# EAGLE design fish-1.0 (EAGLE 7.7.0)
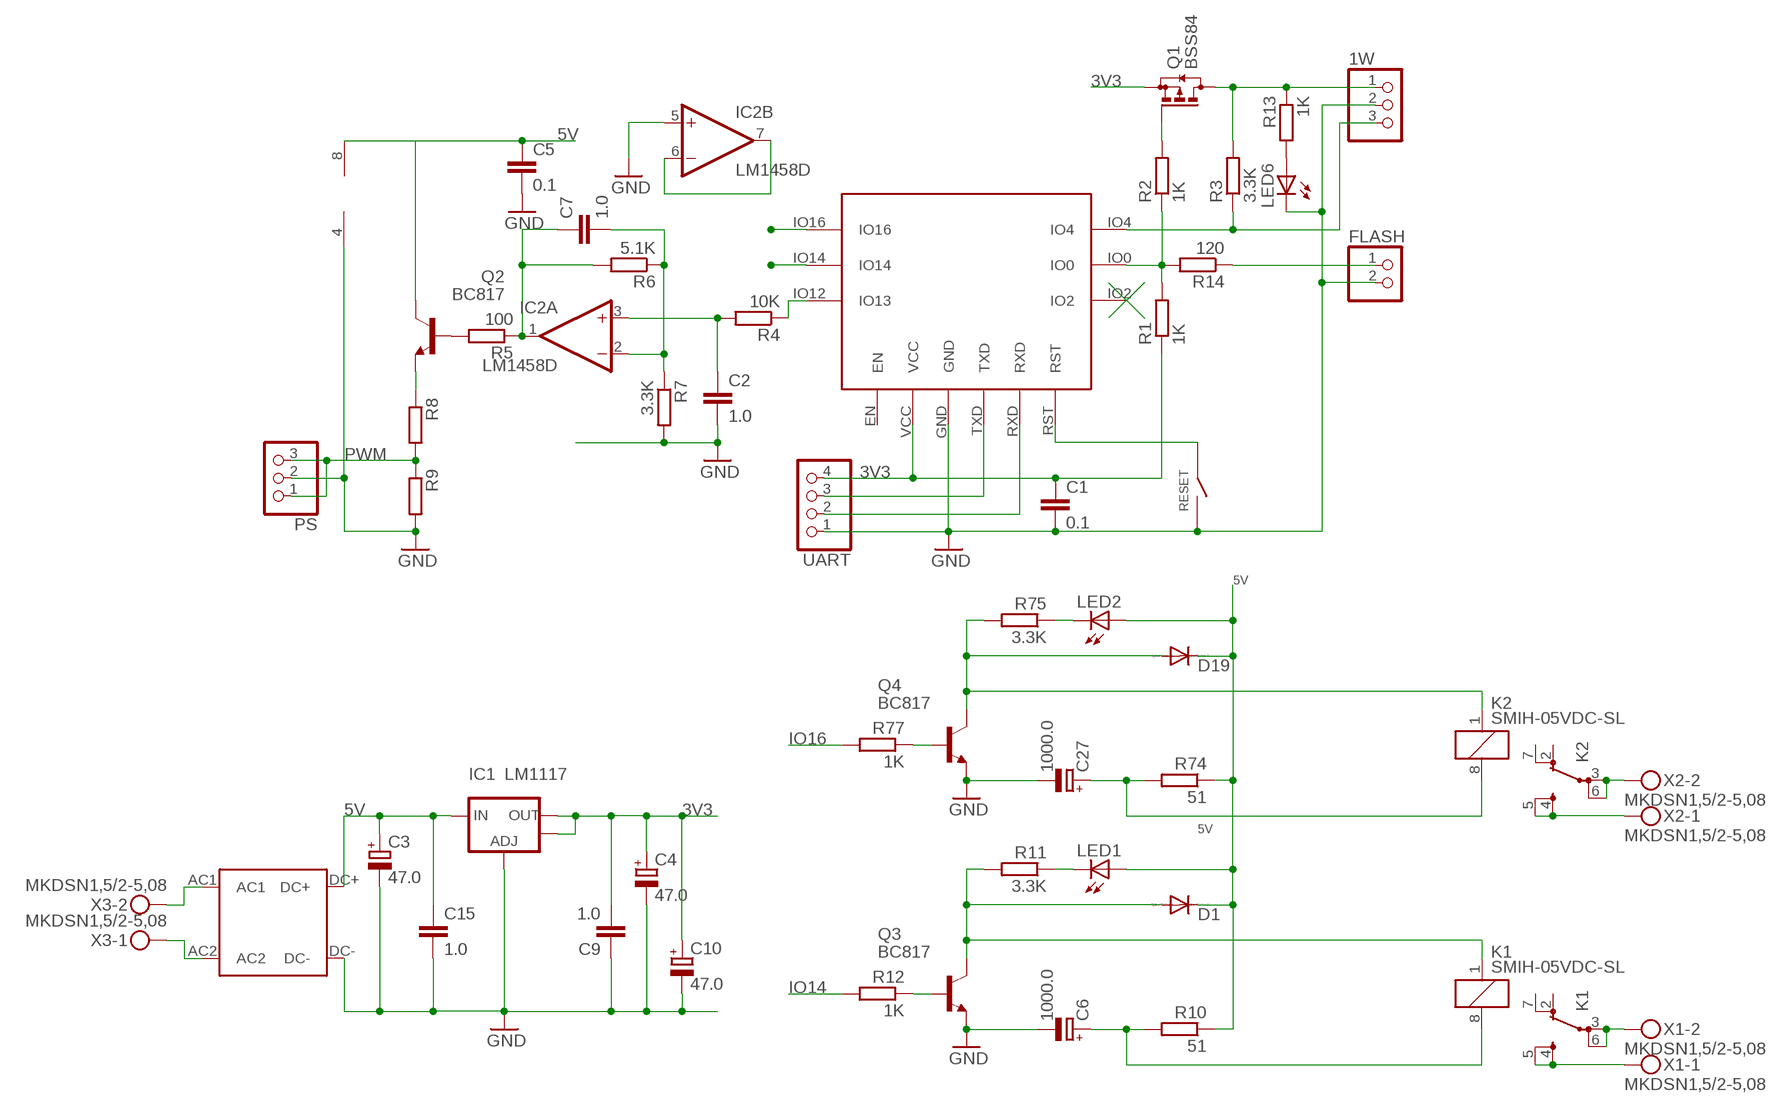
[diagram p0: schematic, sheet 1]

## Parts
1W  PINHD-1X3/90  [1X03/90]
C1  0.1  C-EUC0805  [C0805]
C2  1.0  C-EUC0805  [C0805]
C3  47.0  CPOL-EUSMCD  [SMC_D]
C4  47.0  CPOL-EUSMCB  [SMC_B]
C5  0.1  C-EUC0805  [C0805]
C6  1000.0  CPOL-EUE3.5-8  [E3,5-8]
C7  1.0  C-EUC0805  [C0805]
C9  1.0  C-EUC0805  [C0805]
C10  47.0  CPOL-EUSMCD  [SMC_D]
C15  1.0  C-EUC0805  [C0805]
C27  1000.0  CPOL-EUE3.5-8  [E3,5-8]
D1  DIODE-SOD123  [SOD123]
D19  DIODE-SOD123  [SOD123]
ESP-M3  ESP-M3  [ESP-M3]
FLASH  PINHD-1X2/90  [1X02/90]
IC1  LM1117  V_REG_LM1117SOT223  [SOT223]
IC2  LM1458D  [SO08]
K1  SMIH-05VDC-SL  FTR-K1C  [FTR-K1C]
K2  SMIH-05VDC-SL  FTR-K1C  [FTR-K1C]
LED1  LEDSMT1206  [1206]
LED2  LEDSMT1206  [1206]
LED6  LEDSMT1206  [1206]
PS  PINHD-1X3/90  [1X03/90]
Q1  BSS84  [SOT23]
Q2  BC817  BC817-40SMD  [SOT23-BEC]
Q3  BC817  BC817-40SMD  [SOT23-BEC]
Q4  BC817  BC817-40SMD  [SOT23-BEC]
R1  1K  R-EU_R0603  [R0603]
R2  1K  R-EU_R0603  [R0603]
R3  3.3K  R-EU_R0603  [R0603]
R4  10K  R-EU_R0603  [R0603]
R5  100  R-EU_R0603  [R0603]
R6  5.1K  R-EU_R0603  [R0603]
R7  3.3K  R-EU_R0603  [R0603]
R8  R-EU_R0603  [R0603]
R9  R-EU_R0603  [R0603]
R10  51  R-EU_R1206  [R1206]
R11  3.3K  R-EU_R0603  [R0603]
R12  1K  R-EU_R0603  [R0603]
R13  1K  R-EU_R0603  [R0603]
R14  120  R-EU_R0603  [R0603]
R74  51  R-EU_R1206  [R1206]
R75  3.3K  R-EU_R0603  [R0603]
R77  1K  R-EU_R0603  [R0603]
RESET  TACT3X4  [TACT3X4]
U$1  AC-DC/10W-12V  [AC-DC/10W]
UART  PINHD-1X4/90  [1X04/90]
X1  MKDSN1,5/2-5,08  [MKDSN1,5/2-5,08]
X2  MKDSN1,5/2-5,08  [MKDSN1,5/2-5,08]
X3  MKDSN1,5/2-5,08  [MKDSN1,5/2-5,08]

## Nets
1W: 1W.3 ESP-M3.IO4 R3.1
3V3: C1.1 C4.+ C9.2 C10.+ ESP-M3.VCC IC1.2(OUT) IC1.4(OUT) Q1.2(S) R1.1 UART.4
5V: C3.+ C5.1 C15.1 D1.C D19.C IC1.3(IN) IC2.8(P:V+) LED1.A LED2.A Q2.C R10.1 R74.1 U$1.DC+
FLASH: FLASH.1 R14.1
GND: 1W.2 C1.2 C2.2 C3.- C4.- C5.2 C6.- C9.1 C10.- C15.2 C27.- ESP-M3.GND FLASH.2 IC1.1(ADJ) IC2.4(P:V-) IC2.5(B:+IN) LED6.C PS.2 Q3.E Q4.E R7.2 R9.2 RESET.P$2 U$1.DC- UART.1
IO14: ESP-M3.IO14 R12.2
IO16: ESP-M3.IO16 R77.2
N$3: Q1.1(G) R2.2
N$4: U$1.AC1 X3.2
N$5: ESP-M3.IO12(IO13) R4.1
N$6: U$1.AC2 X3.1
N$7: C2.1 IC2.3(A:+IN) R4.2
N$8: C7.1 IC2.1(A:OUT) R5.1 R6.2
N$9: C7.2 IC2.2(A:-IN) R6.1 R7.1
N$10: D1.A K1.1 Q3.C R11.2
N$11: Q2.B R5.2
N$12: Q2.E R8.1
N$13: C6.+ K1.8 R10.2
N$14: LED1.C R11.1
N$15: Q3.B R12.1
N$16: K1.3(-1:PA) K1.6(-1:PB) X1.2
N$17: ESP-M3.IO0 R1.2 R2.1 R14.2
N$18: LED6.A R13.2
N$19: IC2.6(B:-IN) IC2.7(B:OUT)
N$20: K1.4(-1:SA) K1.5(-1:SB) X1.1
N$55: D19.A K2.1 Q4.C R75.2
N$60: C27.+ K2.8 R74.2
N$62: LED2.C R75.1
N$112: Q4.B R77.1
N$128: K2.3(-1:PA) K2.6(-1:PB) X2.2
N$129: K2.4(-1:SA) K2.5(-1:SB) X2.1
PWM: PS.1 PS.3 R8.2 R9.1
RST: ESP-M3.RST RESET.P$1
RX1: ESP-M3.RXD UART.2
TX1: ESP-M3.TXD UART.3
VCC: 1W.1 Q1.3(D) R3.2 R13.1
Unconnected: ESP-M3.EN ESP-M3.IO2 K1.2(-1:OA) K1.7(-1:OB) K2.2(-1:OA) K2.7(-1:OB)

## Library data of the parts
1W PS = pinhead:PINHD-1X3: PIN HEADER
C1 C2 C5 C7 C9 C15 = rcl:C-EU: CAPACITOR, European symbol
C3 C4 C6 C10 C27 = rcl:CPOL-EU: POLARIZED CAPACITOR, European symbol
D1 D19 = diode:DIODE-: DIODE
ESP-M3 = esp8266modules:ESP-M3: ESP8285 Model M3
FLASH = pinhead:PINHD-1X2: PIN HEADER
IC1 = SparkFun:V_REG_LM1117: Voltage Regulator LM1117 Standard adjustable voltage regulator but in SMD form. Spark Fun Electronics SKU : COM-00595
IC2 = linear:*1458: OP AMP
K1 K2 = relay:FTR-K1C: NETZRELAIS FTR-K1CK024W1XUM 16A/250VAC 1 Umschaltkontakt Distributor: Conrad Electronic Bestell Nr.: 504389-13 - 24V Source: http://www.produktinfo.conrad.com/datenblaetter/500000-524999/504384-da-01-de-NETZRELAIS_FTR_K1CK012W1XUM_16A_250VAC.pdf; OC_FARNELL: unknown; OC_NEWARK: unknown
LED1 LED2 LED6 = led:LED: LED OSRAM: - CHIPLED LG R971, LG N971, LY N971, LG Q971, LY Q971, LO R971, LY R971 LH N974, LH R974 LS Q976, LO Q976, LY Q976 LO Q996 - Hyper CHIPLED LW Q18S LB Q993, LB Q99A, LB R99A - SideLED LS A670, LO A670, LY A670, LG A670, LP A670 LB A673, LV A673, LT A673, LW A673 LH A674 LY A675 LS A676, LA A676, LO A676, LY A676, LW A676 LS A679, LY A679, LG A679 - Hyper Micro SIDELED® LS Y876, LA Y876, LO Y876, LY Y876 LT Y87S - SmartLED LW L88C, LW L88S LB L89C, LB L89S, LG L890 LS L89K, LO L89K, LY L89K LS L896, LA L896, LO L896, LY L896 - TOPLED LS T670, LO T670, LY T670, LG T670, LP T670 LSG T670, LSP T670, LSY T670, LOP T670, LYG T670 LG T671, LOG T671, LSG T671 LB T673, LV T673, LT T673, LW T673 LH T674 LS T676, LA T676, LO T676, LY T676, LB T676, LH T676, LSB T676, LW T676 LB T67C, LV T67C, LT T67C, LS T67K, LO T67K, LY T67K, LW E67C LS E67B, LA E67B, LO E67B, LY E67B, LB E67C, LV E67C, LT E67C LW T67C LS T679, LY T679, LG T679 LS T770, LO T770, LY T770, LG T770, LP T770 LB T773, LV T773, LT T773, LW T773 LH T774 LS E675, LA E675, LY E675, LS T675 LS T776, LA T776, LO T776, LY T776, LB T776 LHGB T686 LT T68C, LB T68C - Hyper Mini TOPLED® LB M676 - Mini TOPLED Santana® LG M470 LS M47K, LO M47K, LY M47K Source: http://www.osram.convergy.de LUXEON: - LUMILED® LXK2-PW12-R00, LXK2-PW12-S00, LXK2-PW14-U00, LXK2-PW14-V00 LXK2-PM12-R00, LXK2-PM12-S00, LXK2-PM14-U00 LXK2-PE12-Q00, LXK2-PE12-R00, LXK2-PE12-S00, LXK2-PE14-T00, LXK2-PE14-U00 LXK2-PB12-K00, LXK2-PB12-L00, LXK2-PB12-M00, LXK2-PB14-N00, LXK2-PB14-P00, LXK2-PB14-Q00 LXK2-PR12-L00, LXK2-PR12-M00, LXK2-PR14-Q00, LXK2-PR14-R00 LXK2-PD12-Q00, LXK2-PD12-R00, LXK2-PD12-S00 LXK2-PH12-R00, LXK2-PH12-S00 LXK2-PL12-P00, LXK2-PL12-Q00, LXK2-PL12-R00 Source: www.luxeon.com KINGBRIGHT: KA-3528ASYC Source: www.kingbright.com
Q1 = transistor-small-signal:BSS84: P-CHANNEL MOS FET
Q2-Q4 = transistor-npn:BC817*: NPN Transistor
R1-R14 R74 R75 R77 = rcl:R-EU_: RESISTOR, European symbol
RESET = custom:TACT3X4
U$1 = components:AC-DC/10W-12V
UART = pinhead:PINHD-1X4: PIN HEADER
X1-X3 = con-phoenix-508:MKDSN1,5/2-5,08: MKDSN 1,5/ 2-5,08 Printklemme Nennstrom: 13,5 A Nennspannung: 250 V Rastermaß: 5,08 mm Polzahl: 2 Anschlussart: Schraubanschluss Montage: Löten Anschlussrichtung Leiter/Platine: 0 ° Artikelnummer: 1729128 Source: http://eshop.phoenixcontact.com .. 1729128.pdf

## Net classes
0 default: width 0.254 mm, clearance 0.254 mm
1 POWER: width 0.508 mm, clearance 0.254 mm

## Board
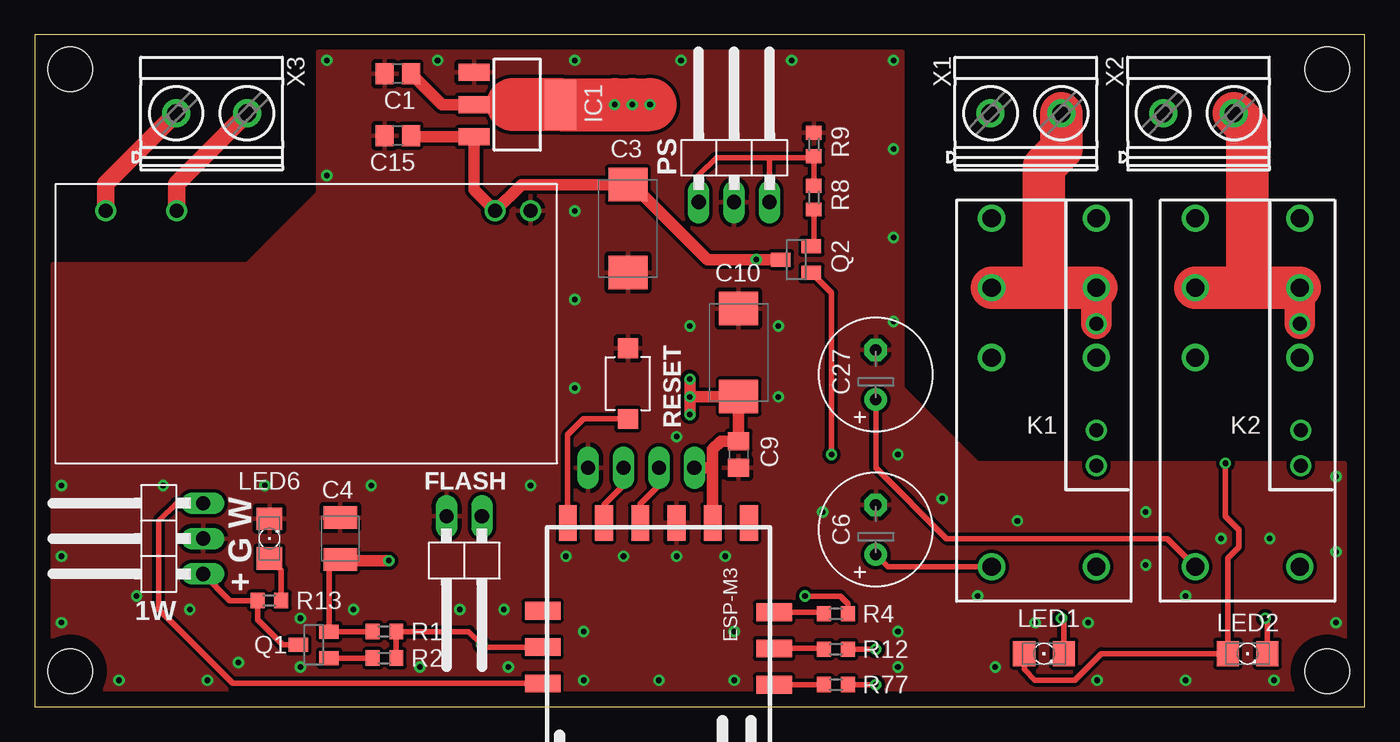
[diagram p1: board, top side]
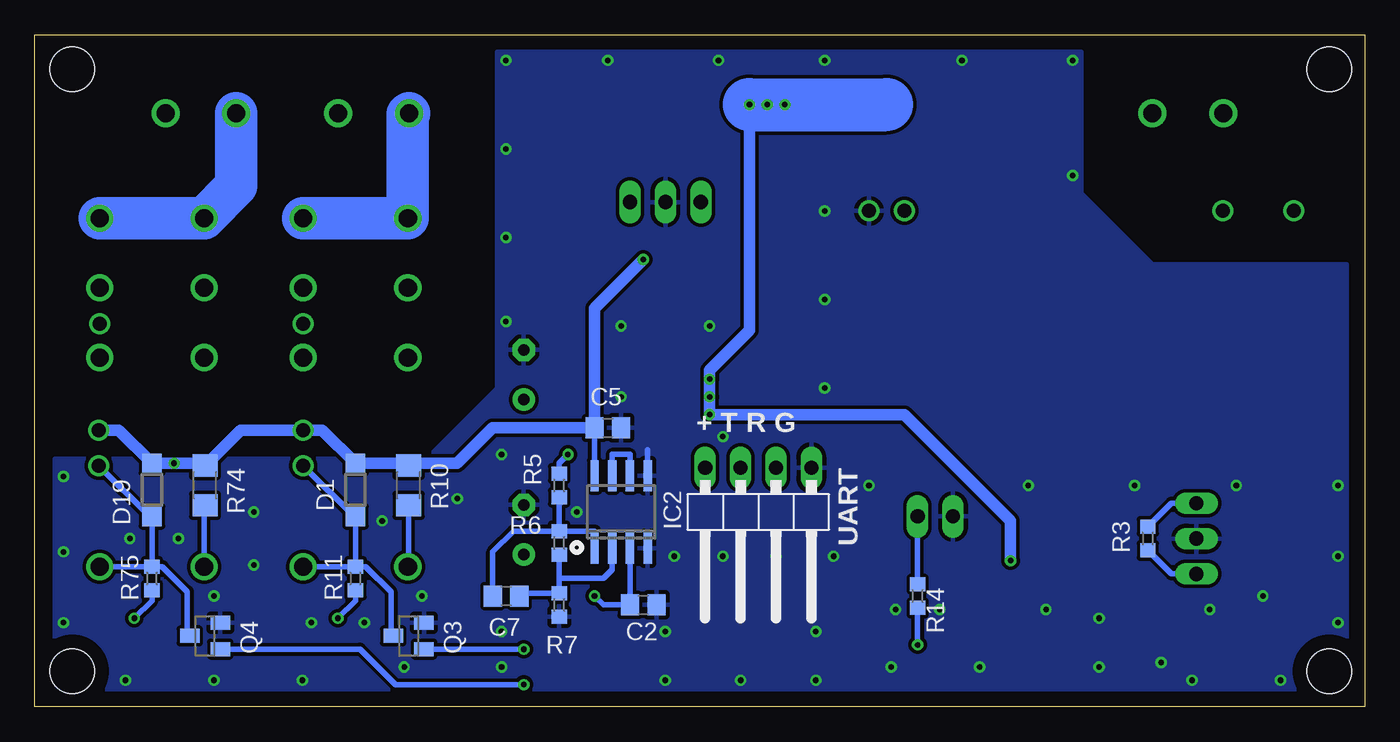
[diagram p2: board, bottom side, seen from below]

Size 95.4 x 48.18 mm. Coordinates in mm from the lower left corner, seen from the top.
Outline: 0,0 95.39,0 95.39,48.18 0,48.18 0,0
Copper layers (1*16): Top 0.035mm / dielectric 1.5mm / Bottom 0.035mm
Design rules "default *": minimum track width 10mil, minimum drill 24mil, track to track 8mil, track to pad 8mil, pad to pad 8mil, via to via 8mil, smd to smd 8mil, copper to edge 40mil, drill to drill 8mil, minimum pad ring 10mil, minimum via ring 8mil, stop-mask expansion 4mil, vias tented up to drill 20mil, thermal gap 12mil
Holes 3.2 mm at 2.54,2.54 2.54,45.72 92.71,2.54 92.71,45.72

### Footprints (pad centres in the part's own frame; a part is rotated, then mirrored left to right if it is on the bottom)
1X03/90 = drill 1.016 long: 1 -2.54,-3.81; 2 0,-3.81; 3 2.54,-3.81
C0805 = smd 1.3 x 1.5: 1 -0.95,0; 2 0.95,0
SMC_D = smd 2.4 x 2.8: + -3.15,0; - 3.15,0
SMC_B = smd 1.6 x 2.4: + -1.5,0; - 1.5,0
E3,5-8 = drill 0.813 pad 1.6: + -1.778,0 | drill 0.813 pad 1.6 octagon: - 1.778,0
SOD123 = smd 1.4 x 1.4: A 1.9,0; C -1.9,0
ESP-M3 = smd 1.27 x 2.54: EN -6.46,-8.1; GND -1.26,-8.1; RST 6.54,-8.1; RXD 3.94,-8.1; TXD 1.34,-8.1; VCC -3.86,-8.1 | smd 2.54 x 1.27: IO0 8.34,0.8; IO2 8.34,-1.8; IO4 8.34,3.4; IO12 -8.26,-1.7; IO14 -8.26,0.9; IO16 -8.26,3.5
1X02/90 = drill 1.016 long: 1 -1.27,-3.81; 2 1.27,-3.81
SOT223 = smd 1.219 x 2.235: 1 -2.311,-3.099; 2 0,-3.099; 3 2.311,-3.099 | smd 3.6 x 2.2: 4 0,3.099
SO08 = smd 0.6 x 2.2: 1 -1.905,-2.6; 2 -0.635,-2.6; 3 0.635,-2.6; 4 1.905,-2.6; 5 1.905,2.6; 6 0.635,2.6; 7 -0.635,2.6; 8 -1.905,2.6
FTR-K1C = drill 1.3 pad 1.93: 1 -12.5,-3.75; 2 2.5,-3.75; 3 7.5,-3.75; 4 12.5,-3.75; 5 12.5,3.75; 6 7.5,3.75; 7 2.5,3.75; 8 -12.5,3.75
1206 = smd 1.6 x 1.803: A -1.422,0; C 1.422,0
SOT23 = smd 1 x 1.4: 1 -0.95,-1.1; 2 0.95,-1.1; 3 0,1.1
SOT23-BEC = smd 1 x 1.4: B -0.95,-1.1; C 0,1.1; E 0.95,-1.1
R0603 = smd 1 x 1.1: 1 -0.85,0; 2 0.85,0
R1206 = smd 1.6 x 1.803: 1 -1.422,0; 2 1.422,0
TACT3X4 = smd 1.422 x 1.422: P$1 -0.635,1.587; P$2 4.445,1.587
AC-DC/10W = drill 1: AC1 10.16,-7.62; AC2 15.24,-7.62; DC+ -12.7,-7.62; DC- -15.24,-7.62
1X04/90 = drill 1.016 long: 1 -3.81,-3.81; 2 -1.27,-3.81; 3 1.27,-3.81; 4 3.81,-3.81
MKDSN1,5/2-5,08 = drill 1.3 pad 2: 1 -2.561,0.025; 2 2.519,0.025

### Placement (x,y rotation side)
1W  8.26,12.06 90 top
C1  26.04,45.4 180 top
C2  51.75,7.3 0 bottom
C3  42.55,34.29 270 top
C4  21.91,12.06 90 top
C5  54.29,20 0 bottom
C6  60.33,12.7 90 top
C7  61.59,7.94 0 bottom
C9  50.48,18.1 90 top
C10  50.48,25.4 90 top
C15  26.04,40.96 180 top
C27  60.33,23.81 90 top
D1  72.39,15.56 270 bottom
D19  87,15.56 270 bottom
ESP-M3  44.77,5.08 180 top
FLASH  30.8,9.84 180 top
IC1  34.61,43.18 270 top
IC2  53.34,13.97 0 bottom
K1  72.39,22.54 90 top
K2  87,22.54 90 top
LED1  72.39,3.81 0 top
LED2  87,3.81 0 top
LED6  16.83,12.06 90 top
PS  50.16,40.01 0 top
Q1  20,4.45 90 top
Q2  54.61,32.07 90 top
Q3  68.58,5.08 90 bottom
Q4  83.19,5.08 90 bottom
R1  25.08,5.4 0 top
R2  25.08,3.49 180 top
R3  15.56,12.06 270 bottom
R4  57.47,6.67 0 top
R5  57.78,15.88 90 bottom
R6  57.78,11.75 90 bottom
R7  57.78,7.3 270 bottom
R8  55.88,36.51 90 top
R9  55.88,40.32 90 top
R10  68.58,15.88 270 bottom
R11  72.39,9.21 90 bottom
R12  57.47,4.13 180 top
R13  16.83,7.62 0 top
R14  32.07,7.94 270 bottom
R74  83.19,15.88 270 bottom
R75  87,9.21 90 bottom
R77  57.47,1.59 180 top
RESET  44.13,21.27 90 top
U$1  20.32,27.94 180 top
UART  43.5,13.34 180 bottom
X1  71.12,42.55 0 top
X2  83.5,42.55 0 top
X3  12.7,42.55 0 top

### Tracks (layer width: path | path; a pad name or v marks a point on that pad's centre or on a via)
1W
  Top 0.406: ESP-M3.IO4 14.2,1.68 8.89,6.99 8.89,13.34 10.16,14.61 1W.3
  Bottom 0.406: 1W.3 13.87,14.61 R3.1
3V3  (via drill 0.4)
  Top 0.406: C4.+ 21.1,9.76 Q1.2 R1.1
  Top 0.813: C1.1 29.21,43.18 IC1.2 34.29,43.18 | ESP-M3.VCC 48.63,17.14 | 48.63,17.14 48.63,18.46 49.21,19.05 C9.2 C10.+ 47.02,22.25 v46.99,22.23 | UART.4 48.63,17.14 | v46.99,20.95 v46.99,22.23 | v46.99,22.23 v46.99,23.5 | v25.4,10.48 22,10.48 C4.+
  Top 3.81: 34.29,43.18 IC1.4 v41.59,43.18 v42.86,43.18 v44.13,43.18
  Bottom 0.813: v44.13,43.18 44.13,26.99 46.99,24.13 v46.99,23.5 v46.99,22.23 v46.99,20.95 33.02,20.95 25.4,13.34 v25.4,10.48
  Bottom 3.81: v44.13,43.18 34.29,43.18
5V  (via drill 0.4, 1)
  Top 0.406: LED1.A 70.97,2.69 71.75,1.91 74.61,1.91 76.52,3.81 LED2.A 85.57,10.64 86.36,11.43 86.36,12.7 85.41,13.65 v85.41,17.46
  Top 0.813: C15.1 27.07,40.87 IC1.3 31.51,37.07 U$1.DC+ 34.9,37.44 C3.+ 42.89,37.44 48.26,32.07 v51.75,32.07 Q2.C
  Bottom 0.406: IC2.8 C5.1
  Bottom 0.813: v51.75,32.07 55.24,28.58 C5.1 62.55,20 65.09,17.46 68.58,17.46 | 83.35,17.46 R74.1 | v90.81,19.84 89.38,19.84 D19.C v85.41,17.46 83.35,17.46 R74.1 | R74.1 80.64,19.84 v76.15,19.84 74.77,19.84 D1.C 68.58,17.46 | R10.1 68.58,17.46
FLASH
  Bottom 0.406: R14.1 FLASH.1
GND  (via drill 0.4)
  Bottom 0.406: IC2.5 51.44,18.41
  other vias: 38.73,22.86 35.56,15.88 38.73,29.21 38.73,35.56 24.13,15.88 16.51,15.88 46.99,27.3 9.21,15.88 1.91,15.88 1.91,10.79 1.91,6.03 6.03,1.91 12.38,1.91 11.11,6.99 14.61,3.17 19.05,2.86 27.62,2.86 33.97,2.86 39.37,1.91 38.1,10.79 44.77,1.91 50.16,1.91 42.23,10.79 46.04,10.79 49.53,10.79 61.91,2.86 61.91,5.4 68.9,2.86 65.09,14.92 79.69,13.97 71.75,6.03 75.56,6.03 88.9,1.91 93.34,6.03 93.34,11.11 93.34,16.51 61.59,46.35 54.29,46.35 46.35,46.35 38.73,46.35 28.89,46.35 20.95,38.1 20.95,46.35 61.91,18.1 82.55,1.91 76.2,1.91 67.63,7.94 82.55,7.94 61.59,40.01 61.59,33.66 61.59,27.62 50.16,5.4 39.37,5.4 46.04,19.37 22.86,6.99 19.05,6.35 7.3,7.94 30.48,6.99 33.66,6.99 53.34,22.23 53.34,27.3 56.52,13.97 85.09,12.06 70.48,13.34 88.58,12.06 79.69,10.16
  pour Top: 1.27,31.75 15.24,31.75 20.32,36.83 20.32,46.99 62.23,46.99 62.23,22.86 67.63,17.46 93.98,17.46 93.98,1.27 1.27,1.27
  pour Bottom: 1.27,31.75 15.24,31.75 20.32,36.83 20.32,46.99 62.23,46.99 62.23,22.86 67.31,17.78 93.98,17.78 93.98,1.27 1.27,1.27
IO14
  Top 0.406: ESP-M3.IO14 56.56,4.18 R12.2
IO16
  Top 0.406: ESP-M3.IO16 R77.2
N$3
  Top 0.406: R2.2 Q1.1
N$4
  Top 1.27: U$1.AC1 10.16,37.51 X3.2
N$5
  Top 0.406: ESP-M3.IO12 56.51,6.78 R4.1
N$6
  Top 1.27: U$1.AC2 5.08,37.51 X3.1
N$7  (via drill 0.4)
  Top 0.406: R4.2 58.32,7.41 57.78,7.94 v55.24,7.94
  Bottom 0.406: v55.24,7.94 54.61,7.3 C2.1 IC2.3
N$8
  Bottom 0.406: 57.68,14.61 R5.1 R6.2 | IC2.1 55.24,12.6 R6.2 | C7.1 62.55,11.12 61.06,12.6 R6.2
N$9
  Bottom 0.406: 57.78,9.21 R7.1 60.43,8.15 C7.2 | 57.78,9.21 R6.1 | 57.78,9.21 54.61,9.21 53.98,9.84 IC2.2
N$10  (via drill 1)
  Bottom 0.406: 76.2,10.1 K1.1 72.41,10.04 R11.2 | R11.2 71.65,10.06 69.85,8.26 69.85,5.25 Q3.C | R11.2 D1.A 72.51,13.66 v76.15,17.3
N$11  (via drill 0.4)
  Top 0.406: v57.15,18.1 57.15,29.68 Q2.B
  Bottom 0.406: R5.2 57.78,17.46 v57.15,18.1
N$12
  Top 0.406: R8.1 55.88,33.19 Q2.E
N$13
  Top 0.406: K1.8 61.2,10.04 C6.+
  Bottom 0.406: K1.8 68.58,10.1 R10.2
N$14  (via drill 0.4)
  Top 0.406: LED1.C 73.81,6.2 v73.66,6.35
  Bottom 0.406: R11.1 72.39,7.62 v73.66,6.35
N$15  (via drill 0.4)
  Top 0.406: R12.1 v60.33,4.13
  Bottom 0.406: Q3.B v60.33,4.13
N$16  (via drill 1)
  Top 2.184: v76.15,27.46 K1.3
  Top 3.048: K1.3 72.71,30.04 | 72.71,30.04 K1.6 | X1.2 73.64,39.98 72.39,38.73 72.39,30.36 72.71,30.04
N$17  (via drill 0.4)
  Top 0.406: R2.1 R1.2 31.11,5.4 v32.07,4.45 32.23,4.28 ESP-M3.IO0
  Bottom 0.406: R14.2 v32.07,4.45
N$18
  Top 0.406: R13.2 17.68,9.79 LED6.A
N$19
  Bottom 0.406: IC2.6 52.7,18.1 53.98,18.1 IC2.7
N$20
  Bottom 3.048: X1.1 68.64,42.49 K1.5 K1.4
N$55  (via drill 1)
  Bottom 0.406: 90.81,10.1 K2.1 87.01,10.04 R75.2 | R75.2 86.26,10.06 84.45,8.26 84.45,5.25 Q4.C | R75.2 D19.A 87.17,13.66 v90.81,17.3
N$60
  Top 0.406: C27.+ 60.33,17.14 65.41,12.06 81.22,12.06 K2.8
  Bottom 0.406: K2.8 83.25,14.39 R74.2
N$62  (via drill 0.4)
  Top 0.406: LED2.C 88.42,6.2 v88.27,6.35
  Bottom 0.406: R75.1 87,7.62 v88.27,6.35
N$112  (via drill 0.4)
  Top 0.406: R77.1 v60.33,1.59
  Bottom 0.406: Q4.B 72.08,4.13 69.53,1.59 v60.33,1.59
N$128  (via drill 1)
  Top 2.184: v90.75,27.46 v90.75,27.47 K2.3
  Top 3.048: K2.3 87,30.04 | 87,30.04 K2.6 | X2.2 87,41.6 87,30.04
N$129
  Bottom 3.048: X2.1 80.94,37.35 K2.5 K2.4
PWM
  Top 0.406: R8.2 R9.1 55.78,39.37 52.7,39.37 | PS.1 47.62,38.1 48.9,39.37 52.7,39.37 | PS.3 52.7,39.37
RST
  Top 0.406: ESP-M3.RST 38.23,19.5 39.37,20.64 RESET.P$1
RX1
  Top 0.406: ESP-M3.RXD 40.83,14.47 42.23,15.88 UART.2
TX1
  Top 0.406: ESP-M3.TXD 43.43,14.54 44.77,15.88 UART.3
VCC
  Top 0.406: Q1.3 17.78,4.45 15.98,6.25 R13.1 13.97,7.62 1W.1
  Bottom 0.406: 1W.1 13.87,9.53 R3.2

### Text on the board
tNames: RESET | + G W
bNames: + T R G